# EAGLE schematic schematic (EAGLE 6.6.0)
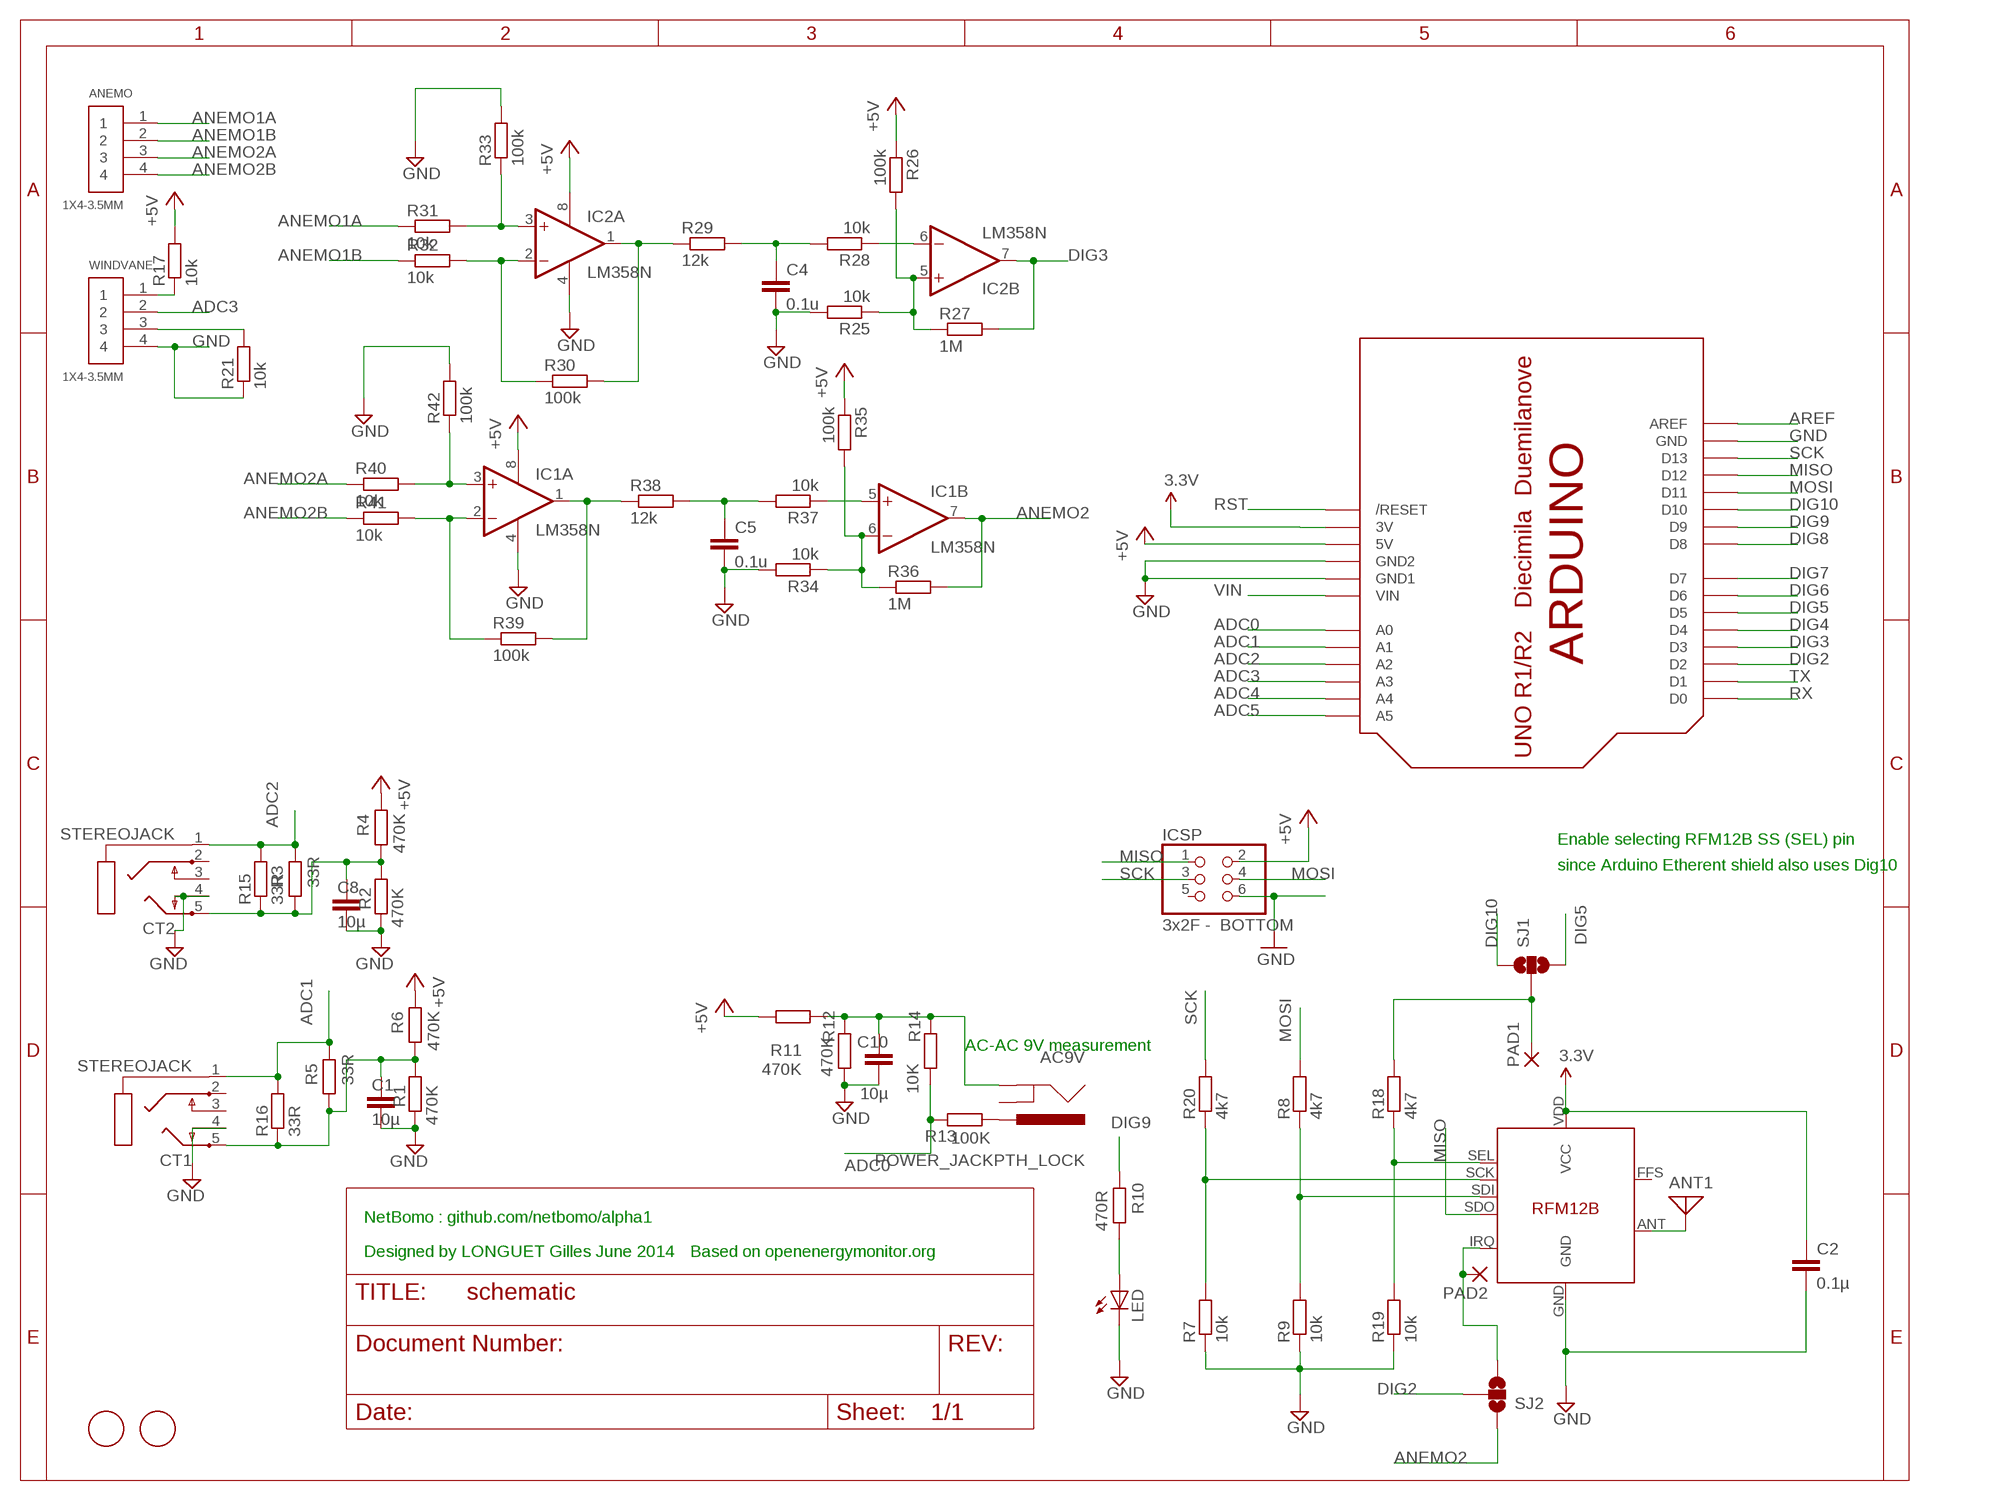
[diagram p0: schematic, sheet 1]

## Parts
AC9V  POWER_JACKPTH_LOCK  [POWER_JACK_PTH_LOCK]
ANEMO  1X4-3.5MM  [1X04-3.5MM]
ANT1  ANTENNA  [PAD-01]
C1  10µ  C-EUC0603  [C0603]
C2  0.1µ  C-EUC0603  [C0603]
C4  0.1u  C-EU025_050-025X075  [C025_050-025X075]
C5  0.1u  C-EU025_050-025X075  [C025_050-025X075]
C8  10µ  C-EUC0603  [C0603]
C10  10µ  C-EUC0603  [C0603]
CT1  STEREOJACK  [STX3100]
CT2  STEREOJACK  [STX3100]
IC1  LM358N  [DIL08]
IC2  LM358N  [DIL08]
ICSP  3x2F - BOTTOM  PINHD-2X3  [2X03]
LED  LEDCHIPLED_0805  [CHIPLED_0805]
PAD1  JEELABS_1,6/0,8  [JEELABS_1,6/0,8]
PAD2  JEELABS_1,6/0,8  [JEELABS_1,6/0,8]
R1  470K  R-EU_R0603  [R0603]
R2  470K  R-EU_R0603  [R0603]
R3  33R  R-EU_0204/7  [0204/7]
R4  470K  R-EU_R0603  [R0603]
R5  33R  R-EU_0204/7  [0204/7]
R6  470K  R-EU_R0603  [R0603]
R7  10k  R-EU_R0603  [R0603]
R8  4k7  R-EU_R0603  [R0603]
R9  10k  R-EU_R0603  [R0603]
R10  470R  R-EU_R0603  [R0603]
R11  470K  R-EU_R0603  [R0603]
R12  470K  R-EU_R0603  [R0603]
R13  100K  R-EU_R0603  [R0603]
R14  10K  R-EU_R0603  [R0603]
R15  33R  R-EU_R1206  [R1206]
R16  33R  R-EU_R1206  [R1206]
R17  10k  R-EU_0204/7  [0204/7]
R18  4k7  R-EU_R0603  [R0603]
R19  10k  R-EU_R0603  [R0603]
R20  4k7  R-EU_R0603  [R0603]
R21  10k  R-EU_0204/7  [0204/7]
R25  10k  R-EU_0204/7  [0204/7]
R26  100k  R-EU_0204/7  [0204/7]
R27  1M  R-EU_0204/7  [0204/7]
R28  10k  R-EU_0204/7  [0204/7]
R29  12k  R-EU_0204/7  [0204/7]
R30  100k  R-EU_0204/7  [0204/7]
R31  10k  R-EU_0204/7  [0204/7]
R32  10k  R-EU_0204/7  [0204/7]
R33  100k  R-EU_0204/7  [0204/7]
R34  10k  R-EU_0204/7  [0204/7]
R35  100k  R-EU_0204/7  [0204/7]
R36  1M  R-EU_0204/7  [0204/7]
R37  10k  R-EU_0204/7  [0204/7]
R38  12k  R-EU_0204/7  [0204/7]
R39  100k  R-EU_0204/7  [0204/7]
R40  10k  R-EU_0204/7  [0204/7]
R41  10k  R-EU_0204/7  [0204/7]
R42  100k  R-EU_0204/7  [0204/7]
SJ1  SOLDERJUMPER_2WAYS  [SJ_3]
SJ2  SOLDERJUMPER_2WAYS  [SJ_3]
U$1  FIDUCIAL  [FIDUCIAL_1MM]
U$2  ARDUINO-BPLACE  [ARDUINO-BPLACE]
U$3  FIDUCIAL  [FIDUCIAL_1MM]
U$4  RFM12B  [RFM12B]
WINDVANE  1X4-3.5MM  [1X04-3.5MM]

## Nets
3.3V [power]: C2.1 U$2.3V U$4.VDD(VCC)
+5V [power]: IC1.8(P:V+) IC2.8(P:V+) ICSP.2 R4.2 R6.2 R11.2 R17.2 R26.1 R35.1 U$2.5V
ADC0: R13.2 R14.1
ADC1: CT1.1 R5.2 R16.2
ADC2: CT2.1 R3.2 R15.2 U$2.A2
ADC3: WINDVANE.2
ANEMO1A: ANEMO.1 R31.1
ANEMO1B: ANEMO.2 R32.1
ANEMO2: IC1.7(B:OUT) R36.2 SJ2.1
ANEMO2A: ANEMO.3 R40.1
ANEMO2B: ANEMO.4 R41.1
DIG2: SJ2.2
DIG3: IC2.7(B:OUT) R27.2
DIG5: SJ1.3
DIG9: R10.2
DIG10: SJ1.1
GND [gnd]: C1.2 C2.2 C4.2 C5.2 C8.2 C10.2 CT1.4 CT2.4 IC1.4(P:V-) IC2.4(P:V-) ICSP.6 LED.C R1.2 R2.2 R7.1 R9.1 R12.1 R19.1 R21.1 R25.2 R33.2 R34.2 R42.2 U$2.GND1 U$2.GND2 U$4.GND WINDVANE.4
MISO: ICSP.1 U$4.SDO
MOSI: ICSP.4 R8.2
N$1: PAD2.1(P) SJ2.3 U$4.IRQ
N$2: PAD1.1(P) R18.2 SJ1.2
N$3: R17.1 WINDVANE.1
N$4: R21.2 WINDVANE.3
N$5: AC9V.PWR R13.1
N$6: IC2.3(A:+IN) R31.2 R33.1
N$7: IC2.2(A:-IN) R30.1 R32.2
N$9: IC2.1(A:OUT) R29.1 R30.2
N$10: C4.1 R28.2 R29.2
N$11: IC2.6(B:-IN) R28.1
N$12: IC2.5(B:+IN) R25.1 R26.2 R27.1
N$14: IC1.3(A:+IN) R40.2 R42.1
N$16: IC1.2(A:-IN) R39.1 R41.2
N$18: IC1.1(A:OUT) R38.1 R39.2
N$19: C5.1 R37.2 R38.2
N$20: IC1.5(B:+IN) R37.1
N$21: IC1.6(B:-IN) R34.1 R35.2 R36.1
N$33: C8.1 CT2.5 R2.1 R3.1 R4.1 R15.1
N$34: AC9V.GND C10.1 R11.1 R12.2 R14.2
N$38: C1.1 CT1.5 R1.1 R5.1 R6.1 R16.1
N$41: LED.A R10.1
N$42: ANT1.1 U$4.ANT
N$43: R7.2 R20.1 U$4.SCK
N$44: R8.1 R9.2 U$4.SDI
N$45: R18.1 R19.2 U$4.SEL
SCK: ICSP.3 R20.2
VIN: U$2.VIN
Unconnected: AC9V.GNDBREAK CT1.2 CT1.3 CT2.2 CT2.3 ICSP.5 U$2.A0 U$2.A1 U$2.A3 U$2.A4 U$2.A5 U$2.AREF U$2.D0 U$2.D1 U$2.D2 U$2.D3 U$2.D4 U$2.D5 U$2.D6 U$2.D7 U$2.D8 U$2.D9 U$2.D10 U$2.D11 U$2.D12 U$2.D13 U$2.RESET(/RESET) U$4.FFS

## Notes on the sheet
- Enable selecting RFM12B SS (SEL) pin
- since Arduino Etherent shield also uses Dig10
- AC-AC 9V measurement
- NetBomo : github.com/netbomo/alpha1
- Designed by LONGUET Gilles June 2014 | Based on openenergymonitor.org

## Power pins joined to a net without a drawn wire
GND: U$2.GND

## Library data of the parts
AC9V = SparkFun:POWER_JACK: Power Jack This is the standard 5.5mm barrel jack for power. The PTH is the most common, proven, reliable, footprint. All others are experimental. The Slot footprint only works if the mill layer is transmitted to the PCB fab house so be warned. Spark Fun Electronics SKU : PRT-00119. Mating wall wart : TOL-00298 (and others)
ANEMO WINDVANE = adafruit:1X4: 4-pin connector
ANT1 = discrete:ANTENNA: Antenna
C1 C2 C4 C5 C8 C10 = rcl:C-EU: CAPACITOR, European symbol
CT1 CT2 = adafruit:STEREOJACK: MIC/HEADPHONE JACK Stereo jack with two switches. Kycon STX3100, CUI SJ1-3555NG and/or 4UCon 05544
IC1 IC2 = linear:LM358: OP AMP also LM158; LM258; LM2904 Source: http://cache.national.com/ds/LM/LM158.pdf
ICSP = pinhead:PINHD-2X3: PIN HEADER
LED = led:LED: LED OSRAM: - CHIPLED LG R971, LG N971, LY N971, LG Q971, LY Q971, LO R971, LY R971 LH N974, LH R974 LS Q976, LO Q976, LY Q976 LO Q996 - Hyper CHIPLED LW Q18S LB Q993, LB Q99A, LB R99A - SideLED LS A670, LO A670, LY A670, LG A670, LP A670 LB A673, LV A673, LT A673, LW A673 LH A674 LY A675 LS A676, LA A676, LO A676, LY A676, LW A676 LS A679, LY A679, LG A679 - Hyper Micro SIDELED® LS Y876, LA Y876, LO Y876, LY Y876 LT Y87S - SmartLED LW L88C, LW L88S LB L89C, LB L89S, LG L890 LS L89K, LO L89K, LY L89K LS L896, LA L896, LO L896, LY L896 - TOPLED LS T670, LO T670, LY T670, LG T670, LP T670 LSG T670, LSP T670, LSY T670, LOP T670, LYG T670 LG T671, LOG T671, LSG T671 LB T673, LV T673, LT T673, LW T673 LH T674 LS T676, LA T676, LO T676, LY T676, LB T676, LH T676, LSB T676, LW T676 LB T67C, LV T67C, LT T67C, LS T67K, LO T67K, LY T67K, LW E67C LS E67B, LA E67B, LO E67B, LY E67B, LB E67C, LV E67C, LT E67C LW T67C LS T679, LY T679, LG T679 LS T770, LO T770, LY T770, LG T770, LP T770 LB T773, LV T773, LT T773, LW T773 LH T774 LS E675, LA E675, LY E675, LS T675 LS T776, LA T776, LO T776, LY T776, LB T776 LHGB T686 LT T68C, LB T68C - Hyper Mini TOPLED® LB M676 - Mini TOPLED Santana® LG M470 LS M47K, LO M47K, LY M47K Source: http://www.osram.convergy.de LUXEON: - LUMILED® LXK2-PW12-R00, LXK2-PW12-S00, LXK2-PW14-U00, LXK2-PW14-V00 LXK2-PM12-R00, LXK2-PM12-S00, LXK2-PM14-U00 LXK2-PE12-Q00, LXK2-PE12-R00, LXK2-PE12-S00, LXK2-PE14-T00, LXK2-PE14-U00 LXK2-PB12-K00, LXK2-PB12-L00, LXK2-PB12-M00, LXK2-PB14-N00, LXK2-PB14-P00, LXK2-PB14-Q00 LXK2-PR12-L00, LXK2-PR12-M00, LXK2-PR14-Q00, LXK2-PR14-R00 LXK2-PD12-Q00, LXK2-PD12-R00, LXK2-PD12-S00 LXK2-PH12-R00, LXK2-PH12-S00 LXK2-PL12-P00, LXK2-PL12-Q00, LXK2-PL12-R00 Source: www.luxeon.com KINGBRIGHT: KA-3528ASYC Source: www.kingbright.com
PAD1 PAD2 = jeenodes:JEELABS_1,6/0,8: THROUGH-HOLE PAD
R1-R21 R25-R42 = rcl:R-EU_: RESISTOR, European symbol
SJ1 SJ2 = SparkFun:SOLDERJUMPER_2WAY: Solder Jumper 2 way solder jumper
U$1 U$3 = adafruit:FIDUCIAL: For use by pick and place machines to calibrate the vision/machine, 1mm By microbuilder.eu
U$2 = adafruit:ARDUINO: Arduino Diecimila/Duemilanove Make a shield with ease, this package has all the named pins as well as the two mounting drill holes and an outline of the USB and DC power connector. The outline is on the DIMENSION layer, so if your board house uses it they will cut the outline to match. http://www.ladyada.net/library/pcb/eaglelibrary.html
U$4 = JeeParts:RFM12B

## Net classes
0 default: width 0.203 mm, drill 0.6 mm, clearance 0.203 mm
1 power: width 0.305 mm, drill 0.6 mm, clearance 0.254 mm
2 gnd: width 0.254 mm, drill 0.6 mm, clearance 0.254 mm